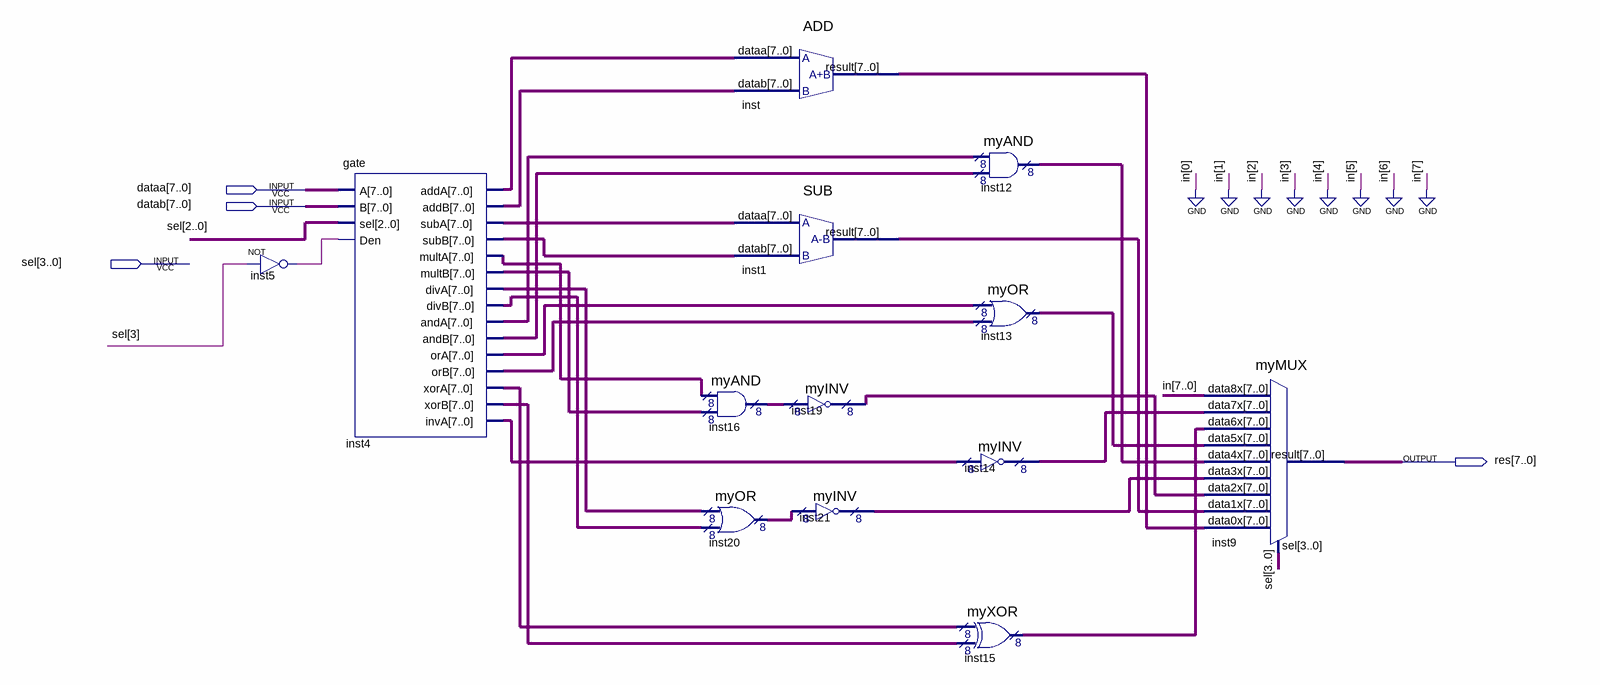
[diagram p0: schematic sheet]
// Quartus schematic 8cal.bdf as structural Verilog: 13 symbols, 4 pins
module \8cal  (
  input  [7:0] dataa,
  input  [7:0] datab,
  input  [3:0] sel,
  output [7:0] res
);

  wire inst5_out;
  wire [7:0] inst1_result, inst4_adda, inst4_addb, inst4_anda, inst4_andb, inst4_diva, inst4_divb,
       inst4_inva, inst4_multa, inst4_multb, inst4_ora, inst4_orb, inst4_suba, inst4_subb, inst4_xora,
       inst4_xorb, inst12_result, inst13_result, inst14_result, inst15_result, inst16_result, inst19_result,
       inst20_result, inst21_result, inst_result;

  not inst5 (inst5_out, sel[3]);
  gate inst4 (
    .A(dataa), .B(datab), .sel(sel[2:0]), .Den(inst5_out), .addA(inst4_adda), .addB(inst4_addb),
    .subA(inst4_suba), .subB(inst4_subb), .multA(inst4_multa), .multB(inst4_multb), .divA(inst4_diva),
    .divB(inst4_divb), .andA(inst4_anda), .andB(inst4_andb), .orA(inst4_ora), .orB(inst4_orb),
    .xorA(inst4_xora), .xorB(inst4_xorb), .invA(inst4_inva));
  myAND inst16 (.data0x(inst4_multa), .data1x(inst4_multb), .result(inst16_result));
  myOR inst20 (.data0x(inst4_diva), .data1x(inst4_divb), .result(inst20_result));
  ADD inst (.dataa(inst4_adda), .datab(inst4_addb), .result(inst_result));
  SUB inst1 (.dataa(inst4_suba), .datab(inst4_subb), .result(inst1_result));
  myINV inst19 (.data(inst16_result), .result(inst19_result));
  myINV inst21 (.data(inst20_result), .result(inst21_result));
  myINV inst14 (.data(inst4_inva), .result(inst14_result));
  myXOR inst15 (.data0x(inst4_xora), .data1x(inst4_xorb), .result(inst15_result));
  myAND inst12 (.data0x(inst4_anda), .data1x(inst4_andb), .result(inst12_result));
  myOR inst13 (.data0x(inst4_ora), .data1x(inst4_orb), .result(inst13_result));
  myMUX inst9 (
    .data8x({8{1'b0}}), .data7x(inst14_result), .data6x(inst15_result), .data5x(inst13_result),
    .data4x(inst12_result), .data3x(inst21_result), .data2x(inst19_result), .data1x(inst1_result),
    .data0x(inst_result), .sel(sel), .result(res));
endmodule
